# Altium schematic sheet 0171_IMVP VCCCORE_SOC_ .SchDoc
size 848 x 558 mm
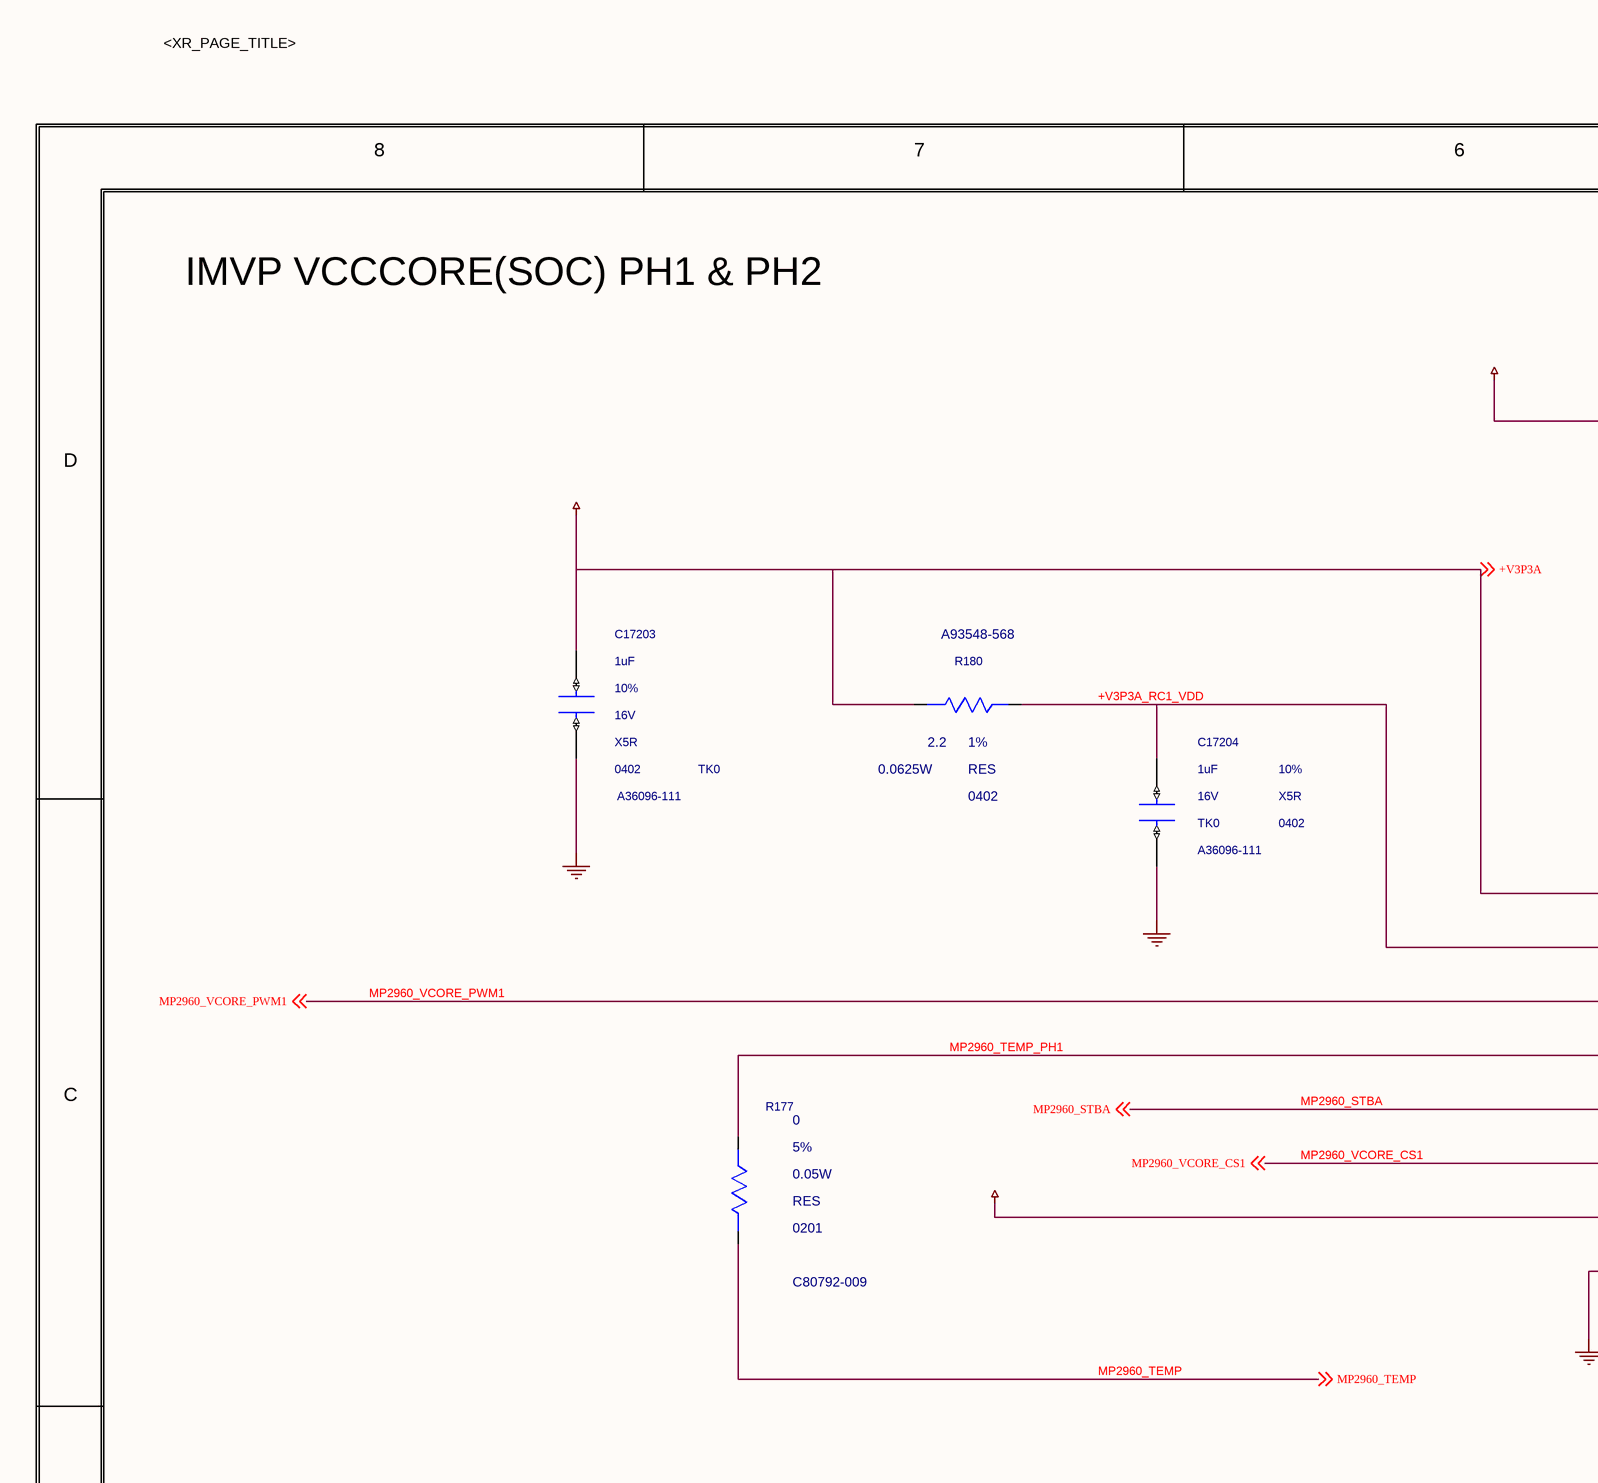
[diagram p0: 0171_IMVP VCCCORE_SOC_ .SchDoc, top left]
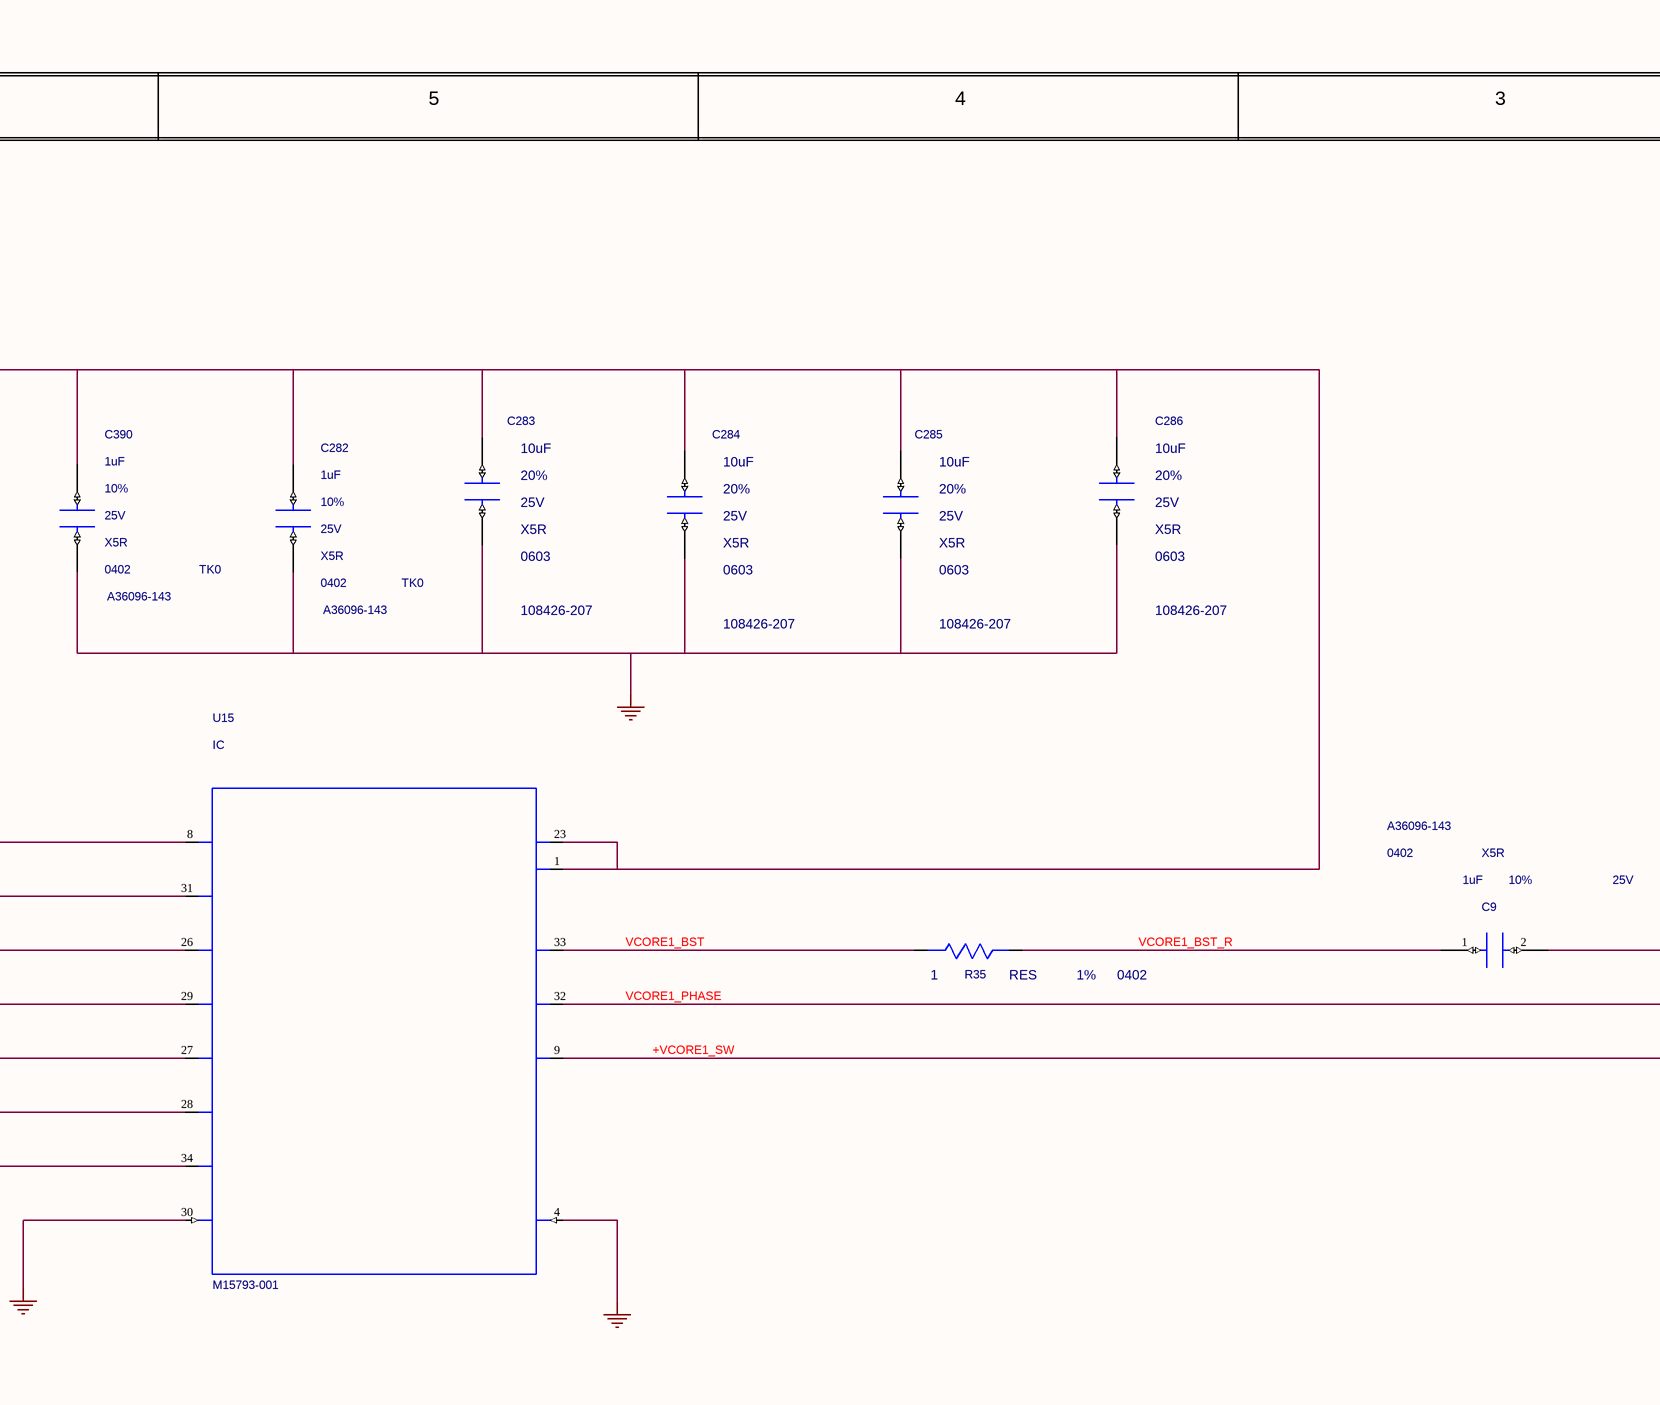
[diagram p1: 0171_IMVP VCCCORE_SOC_ .SchDoc, top middle]
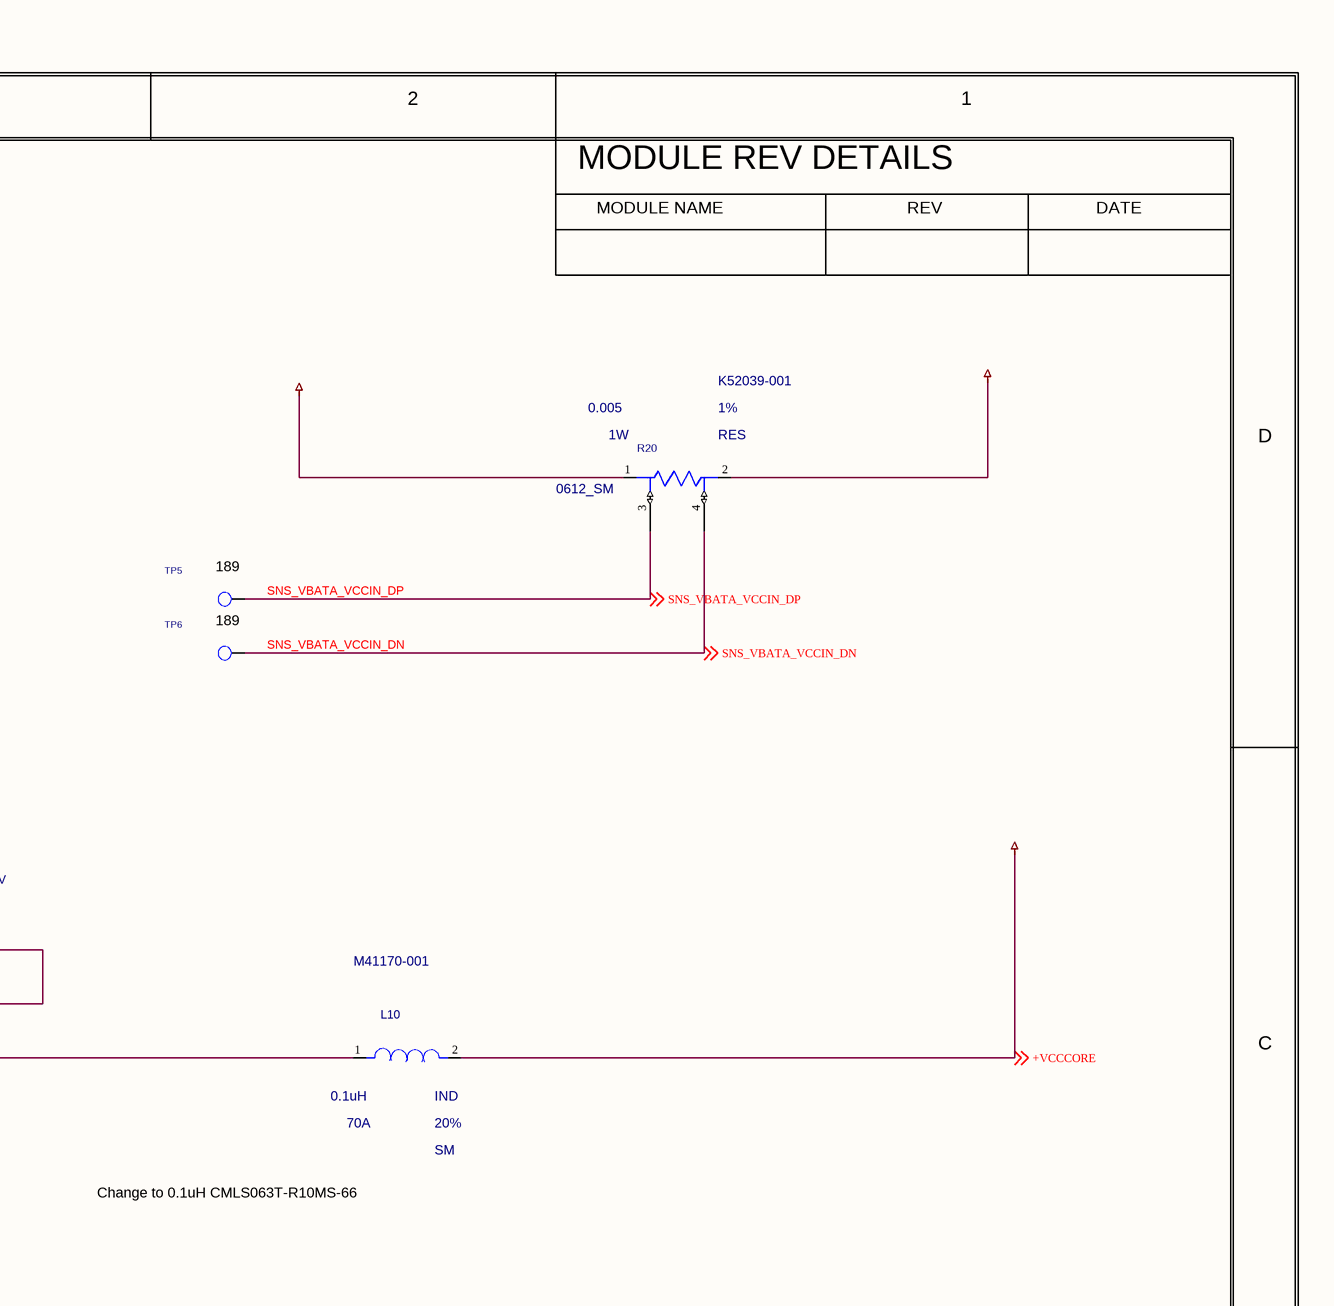
[diagram p2: 0171_IMVP VCCCORE_SOC_ .SchDoc, top right]
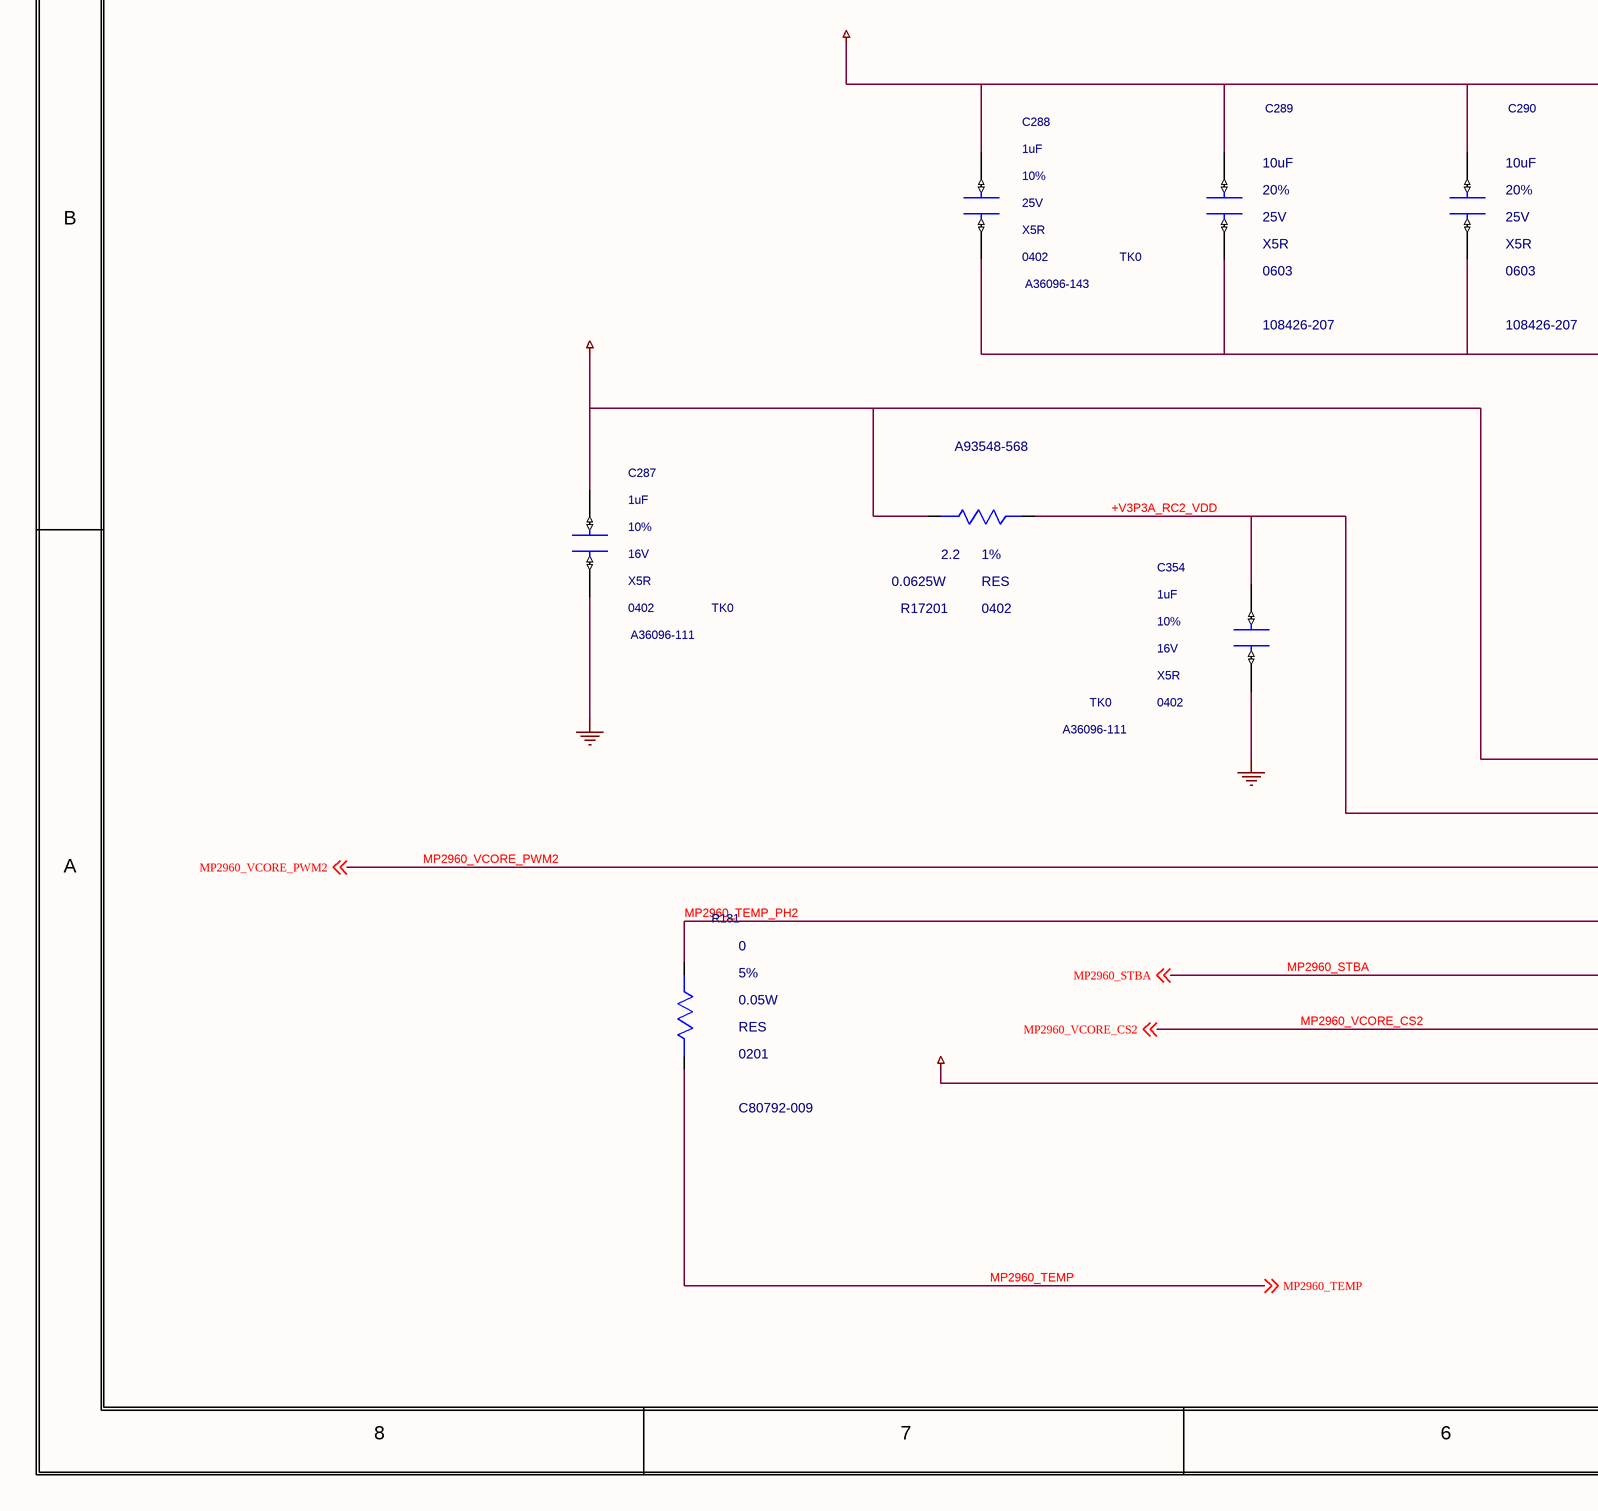
[diagram p3: 0171_IMVP VCCCORE_SOC_ .SchDoc, bottom left]
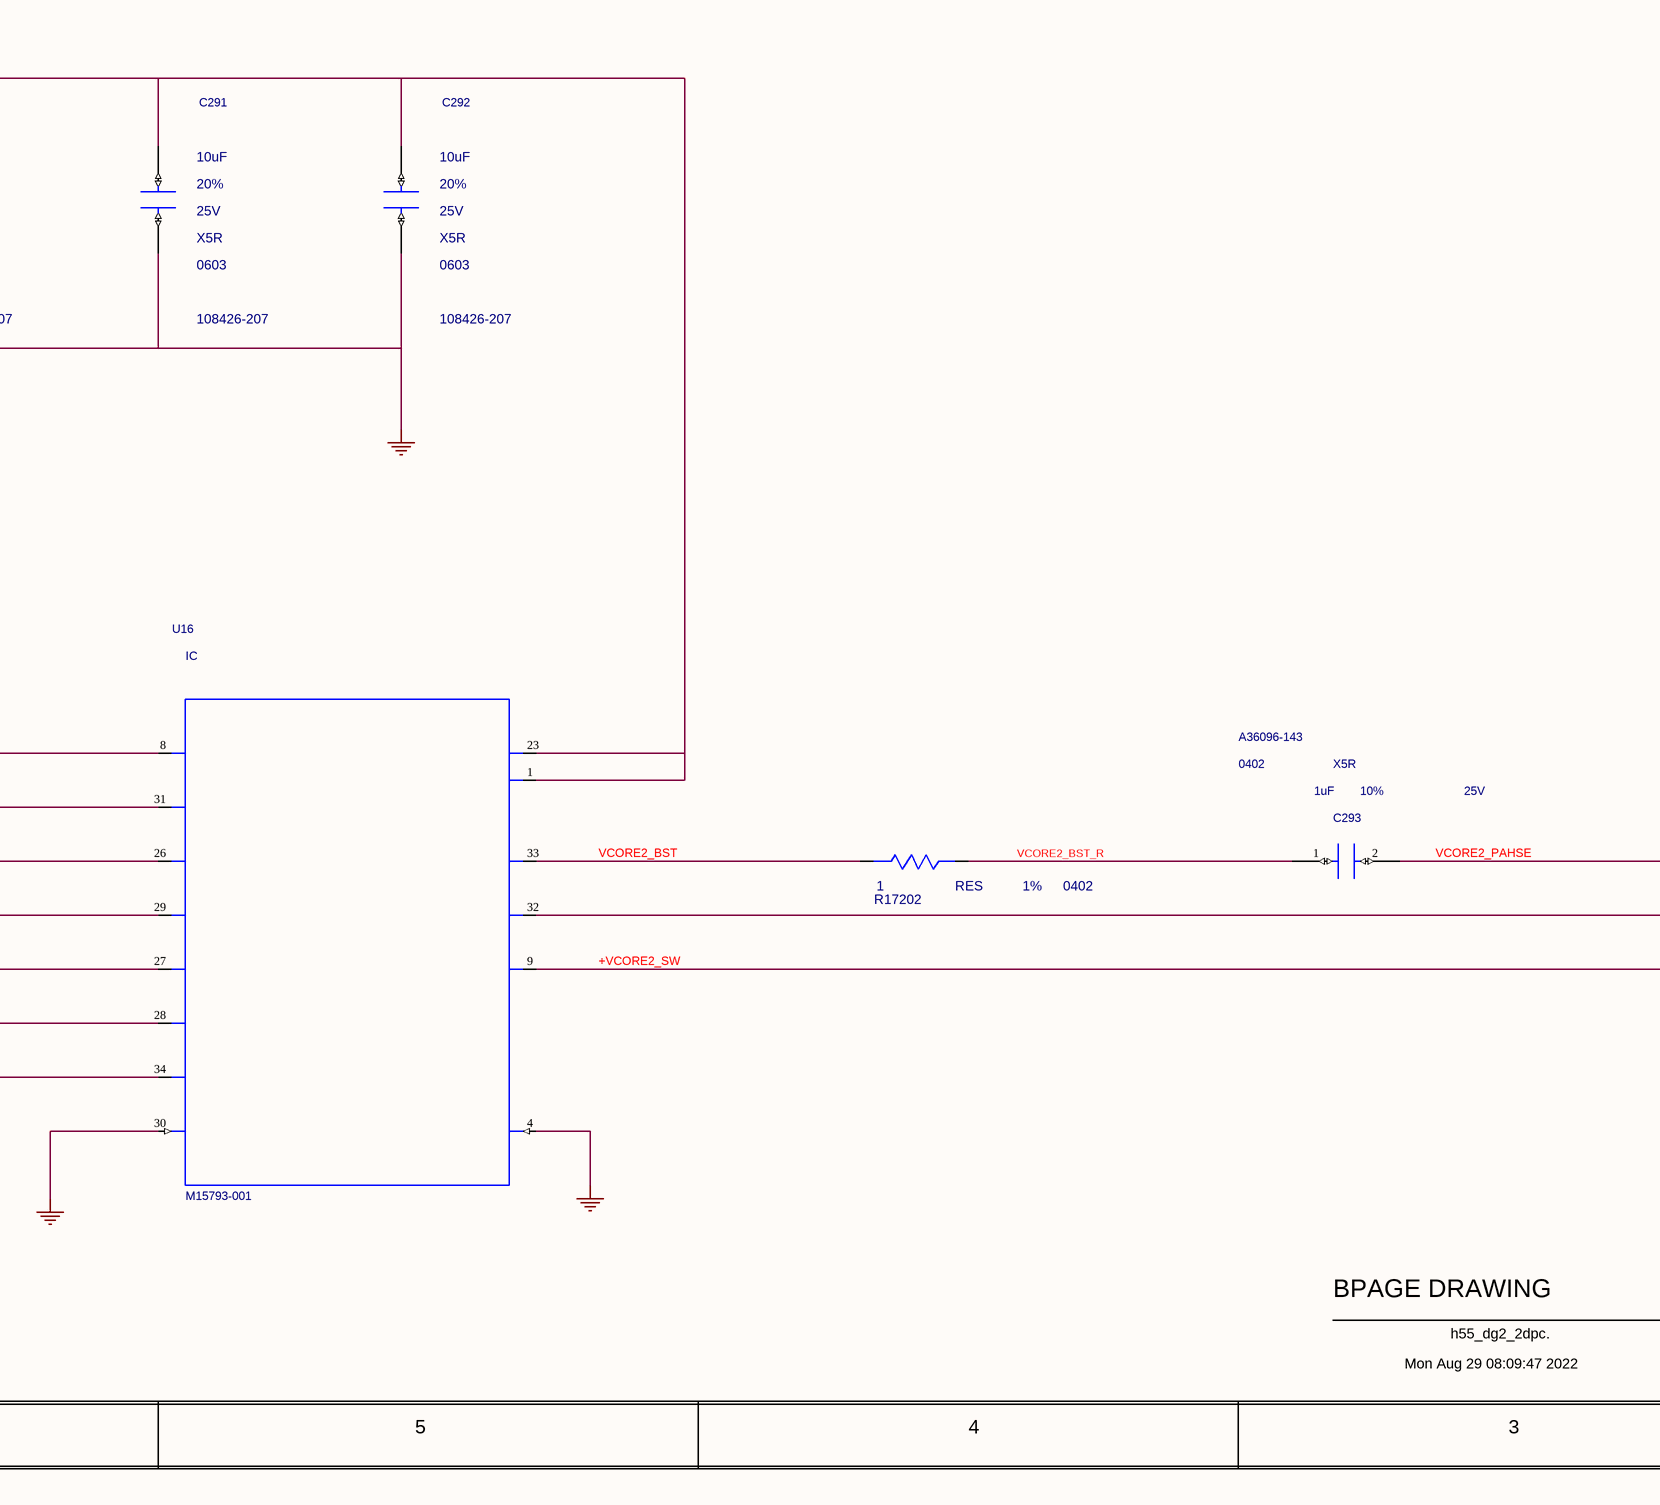
[diagram p4: 0171_IMVP VCCCORE_SOC_ .SchDoc, bottom middle]
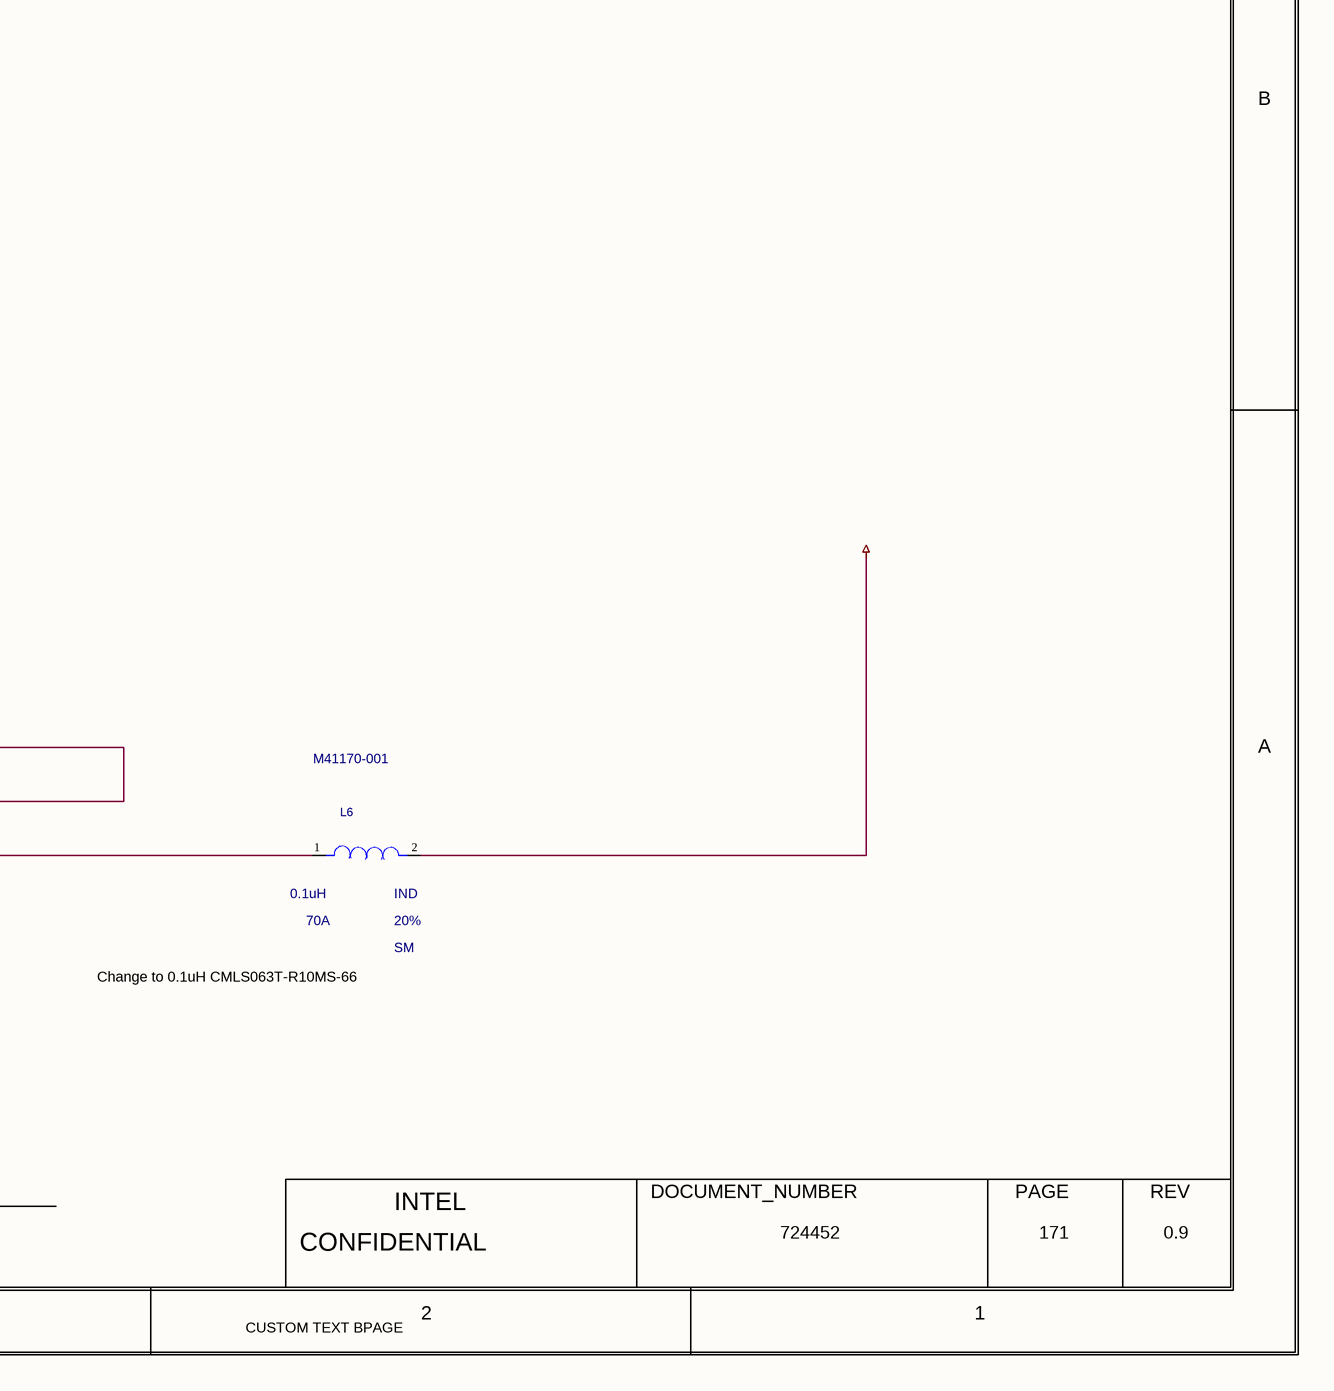
[diagram p5: 0171_IMVP VCCCORE_SOC_ .SchDoc, bottom right]

## Parts
C9  1uF  MATERIAL: X5R  PACK_TYPE: 0402  PART_NUMBER: A36096-143  TOLERANCE: 10%  VOLTAGE: 25V  [SMC0402MA]
C282  1uF  FP_TECH: TK0  MATERIAL: X5R  PACK_TYPE: 0402  PART_NUMBER: A36096-143  TOLERANCE: 10%  VOLTAGE: 25V  [CTK0_SM0402_1050X550_MA]
C283  10uF  MATERIAL: X5R  PACK_TYPE: 0603  PART_NUMBER: 108426-207  TOLERANCE: 20%  VOLTAGE: 25V  [CTK2_SM0603_1800X1000_MA]
C284  10uF  MATERIAL: X5R  PACK_TYPE: 0603  PART_NUMBER: 108426-207  TOLERANCE: 20%  VOLTAGE: 25V  [CTK2_SM0603_1800X1000_MA]
C285  10uF  MATERIAL: X5R  PACK_TYPE: 0603  PART_NUMBER: 108426-207  TOLERANCE: 20%  VOLTAGE: 25V  [CTK2_SM0603_1800X1000_MA]
C286  10uF  MATERIAL: X5R  PACK_TYPE: 0603  PART_NUMBER: 108426-207  TOLERANCE: 20%  VOLTAGE: 25V  [CTK2_SM0603_1800X1000_MA]
C287  1uF  FP_TECH: TK0  MATERIAL: X5R  PACK_TYPE: 0402  PART_NUMBER: A36096-111  TOLERANCE: 10%  VOLTAGE: 16V  [CTK0_SM0402_1050X550_MA]
C288  1uF  FP_TECH: TK0  MATERIAL: X5R  PACK_TYPE: 0402  PART_NUMBER: A36096-143  TOLERANCE: 10%  VOLTAGE: 25V  [CTK0_SM0402_1050X550_MA]
C289  10uF  MATERIAL: X5R  PACK_TYPE: 0603  PART_NUMBER: 108426-207  TOLERANCE: 20%  VOLTAGE: 25V  [CTK2_SM0603_1800X1000_MA]
C290  10uF  MATERIAL: X5R  PACK_TYPE: 0603  PART_NUMBER: 108426-207  TOLERANCE: 20%  VOLTAGE: 25V  [CTK2_SM0603_1800X1000_MA]
C291  10uF  MATERIAL: X5R  PACK_TYPE: 0603  PART_NUMBER: 108426-207  TOLERANCE: 20%  VOLTAGE: 25V  [CTK2_SM0603_1800X1000_MA]
C292  10uF  MATERIAL: X5R  PACK_TYPE: 0603  PART_NUMBER: 108426-207  TOLERANCE: 20%  VOLTAGE: 25V  [CTK2_SM0603_1800X1000_MA]
C293  1uF  MATERIAL: X5R  PACK_TYPE: 0402  PART_NUMBER: A36096-143  TOLERANCE: 10%  VOLTAGE: 25V  [SMC0402MA]
C354  1uF  FP_TECH: TK0  MATERIAL: X5R  PACK_TYPE: 0402  PART_NUMBER: A36096-111  TOLERANCE: 10%  VOLTAGE: 16V  [CTK0_SM0402_1050X550_MA]
C390  1uF  FP_TECH: TK0  MATERIAL: X5R  PACK_TYPE: 0402  PART_NUMBER: A36096-143  TOLERANCE: 10%  VOLTAGE: 25V  [CTK0_SM0402_1050X550_MA]
C17203  1uF  FP_TECH: TK0  MATERIAL: X5R  PACK_TYPE: 0402  PART_NUMBER: A36096-111  TOLERANCE: 10%  VOLTAGE: 16V  [CTK0_SM0402_1050X550_MA]
C17204  1uF  FP_TECH: TK0  MATERIAL: X5R  PACK_TYPE: 0402  PART_NUMBER: A36096-111  TOLERANCE: 10%  VOLTAGE: 16V  [CTK0_SM0402_1050X550_MA]
L6  0.1uH  CURRENT: 70A  MATERIAL: IND  PACK_TYPE: SM  PART_NUMBER: M41170-001  TOLERANCE: 20%  [CTK2_SM_7300X6800_MA]
L10  0.1uH  CURRENT: 70A  MATERIAL: IND  PACK_TYPE: SM  PART_NUMBER: M41170-001  TOLERANCE: 20%  [CTK2_SM_7300X6800_MA]
R20  0.005  MATERIAL: RES  PACK_TYPE: 0612_SM  PART_NUMBER: K52039-001  TOLERANCE: 1%  WATTAGE: 1W  [CTK0_SMR4_0612_1800X3450_MB_VR]
R35  1  MATERIAL: RES  PACK_TYPE: 0402  TOLERANCE: 1%  [CTK0_SM0402_1100X550_MA]
R177  0  MATERIAL: RES  PACK_TYPE: 0201  PART_NUMBER: C80792-009  TOLERANCE: 5%  WATTAGE: 0.05W  [CTK2_SM0201_630X330_MA]
R180  2.2  MATERIAL: RES  PACK_TYPE: 0402  PART_NUMBER: A93548-568  TOLERANCE: 1%  WATTAGE: 0.0625W  [CTK2_SM0402_1100X550_MA]
R181  0  MATERIAL: RES  PACK_TYPE: 0201  PART_NUMBER: C80792-009  TOLERANCE: 5%  WATTAGE: 0.05W  [CTK0_SM0201_630X330_MA]
R17201  2.2  MATERIAL: RES  PACK_TYPE: 0402  PART_NUMBER: A93548-568  TOLERANCE: 1%  WATTAGE: 0.0625W  [CTK2_SM0402_1100X550_MA]
R17202  1  MATERIAL: RES  PACK_TYPE: 0402  TOLERANCE: 1%  [CTK0_SM0402_1100X550_MA]
TP5  TP  [TP_C25]  (value not drawn)
TP6  TP  [TP_C25]  (value not drawn)
U15  MATERIAL: IC  PART_NUMBER: M15793-001  [CTK1_LCC34_4100X6100_450_DF4P_MA_VR]  (hidden comment: C_MP86959)
U16  MATERIAL: IC  PART_NUMBER: M15793-001  [CTK1_LCC34_4100X6100_450_DF4P_MA_VR]  (hidden comment: C_MP86959)

## Nets
+V3P3A: C287.1(A) C17203.1(A) R180.1(A) R17201.1(A) U15.8(VDRV) U15.34(TEST) U16.8(VDRV) U16.34(TEST) ; off-sheet +V3P3A
+VBATA: R20.1(PWRA)
+VBATA_VCCIN: C282.1(A) C283.1(A) C284.1(A) C285.1(A) C286.1(A) C288.1(A) C289.1(A) C290.1(A) C291.1(A) C292.1(A) C390.1(A) R20.2(PWRB) U15.1(VIN_1) U15.23(VIN_2) U16.1(VIN_1) U16.23(VIN_2)
+VCCCORE: L6.2(INB) L10.2(INB) ; off-sheet +VCCCORE
GND: C282.2(B) C283.2(B) C284.2(B) C285.2(B) C286.2(B) C287.2(B) C288.2(B) C289.2(B) C290.2(B) C291.2(B) C292.2(B) C354.2(B) C390.2(B) C17203.2(B) C17204.2(B) U15.4(PGND) U15.30(AGND) U16.4(PGND) U16.30(AGND)
+V3P3A_RC1_VDD: C17204.1(A) R180.2(B) U15.31(VDD)
+V3P3A_RC2_VDD: C354.1(A) R17201.2(B) U16.31(VDD)
+VCORE1_SW: L10.1(INA) U15.9(SW)
+VCORE2_SW: L6.1(INA) U16.9(SW)
MP2960_STBA: U15.27(SYNC) U16.27(SYNC) ; off-sheet MP2960_STBA
MP2960_TEMP: R177.2(B) R181.2(B) ; off-sheet MP2960_TEMP
MP2960_TEMP_PH1: R177.1(A) U15.29(VTEMP_FLT)
MP2960_TEMP_PH2: R181.1(A) U16.29(VTEMP_FLT)
MP2960_VCORE_CS1: U15.28(CS) ; off-sheet MP2960_VCORE_CS1
MP2960_VCORE_CS2: U16.28(CS) ; off-sheet MP2960_VCORE_CS2
MP2960_VCORE_PWM1: U15.26(PWM) ; off-sheet MP2960_VCORE_PWM1
MP2960_VCORE_PWM2: U16.26(PWM) ; off-sheet MP2960_VCORE_PWM2
SNS_VBATA_VCCIN_DN: R20.4(SENB) TP6.1(TP) ; off-sheet SNS_VBATA_VCCIN_DN
SNS_VBATA_VCCIN_DP: R20.3(SENA) TP5.1(TP) ; off-sheet SNS_VBATA_VCCIN_DP
VCORE1_BST: R35.1(A) U15.33(BST)
VCORE1_BST_R: C9.1(A) R35.2(B)
VCORE1_PHASE: C9.2(B) U15.32(PHASE)
VCORE2_BST: R17202.1(A) U16.33(BST)
VCORE2_BST_R: C293.1(A) R17202.2(B)
VCORE2_PAHSE: C293.2(B) U16.32(PHASE)

## Notes on the sheet
- <XR_PAGE_TITLE>
- 8
- 7
- 6
- 5
- 4
- 3
- 2
- 1
- MODULE REV DETAILS
- IMVP VCCCORE(SOC) PH1 & PH2
- MODULE NAME
- REV
- DATE
- D
- (near TP5) 189
- 189
- C
- Change to 0.1uH CMLS063T-R10MS-66
- B
- A
- BPAGE DRAWING
- INTEL
- DOCUMENT_NUMBER
- PAGE
- Mon Aug 29 08:09:47 2022
- h55_dg2_2dpc.
- CONFIDENTIAL
- 724452
- 171
- 0.9
- CUSTOM TEXT BPAGE

## Library data of the parts
C9 = CAP#1: CHIPS_PART_NAME: CAP; CDS_PHYS_PART_NAME: CAP_0402-A36096-143,X5R,1UF,25V,10%,LPDB,GENERIC; OriginalSymbolOrigin: (-25,50); XY: (2675,2975); VER: 2; ROT: 0; PHYS_PAGE: 171; LOCATION: C9; DRAWING: @RVP1_ADL_SB_ADP_S_DDR5_SODIMM_2DPC_LIB.H55_DG2_2DPC(SCH_1):PAGE540; CDS_LIB: discrete; PCB Footprint: SMC0402MA; CDS_PART_NAME: CAP_0402-A36096-143,X5R,1UF,25V,10%,LPDB,GENERIC; CDS_LOCATION: C9
C282 = C_CAP: CDS_PHYS_PART_NAME: C_CAP_0402-A36096-143,X5R,1UF,25V,10%,TK0,GENERIC; CDS_LMAN_SYM_OUTLINE: -50,50,50,-50; IP: GENERIC; ROOM: NONE; OriginalSymbolOrigin: (-50,25); XY: (450,3775); VER: 1; ROT: 0; PHYS_PAGE: 171; LOCATION: C282; DRAWING: @RVP1_ADL_SB_ADP_S_DDR5_SODIMM_2DPC_LIB.H55_DG2_2DPC(SCH_1):PAGE540; CDS_LIB: c_discrete; VARIANT: ?; PCB Footprint: CTK0_SM0402_1050X550_MA; CHIPS_PART_NAME: C_CAP; CDS_PART_NAME: C_CAP_0402-A36096-143,X5R,1UF,25V,10%,TK0,GENERIC; CDS_LOCATION: C282
C283 = C_CAP: CDS_PHYS_PART_NAME: C_CAP_0603-108426-207,X5R,10UF,25V,20%,TK2,GENERIC; CDS_LMAN_SYM_OUTLINE: -50,50,50,-50; FP_TECH: TK2; IP: GENERIC; ROOM: NONE; OriginalSymbolOrigin: (-50,25); XY: (800,3825); VER: 1; ROT: 0; PHYS_PAGE: 171; LOCATION: C283; DRAWING: @RVP1_ADL_SB_ADP_S_DDR5_SODIMM_2DPC_LIB.H55_DG2_2DPC(SCH_1):PAGE540; CDS_LIB: c_discrete; VARIANT: ?; PCB Footprint: CTK2_SM0603_1800X1000_MA; CHIPS_PART_NAME: C_CAP; CDS_PART_NAME: C_CAP_0603-108426-207,X5R,10UF,25V,20%,TK2,GENERIC; CDS_LOCATION: C283
C284 = C_CAP: CDS_PHYS_PART_NAME: C_CAP_0603-108426-207,X5R,10UF,25V,20%,TK2,GENERIC; CDS_LMAN_SYM_OUTLINE: -50,50,50,-50; FP_TECH: TK2; IP: GENERIC; ROOM: NONE; OriginalSymbolOrigin: (-50,25); XY: (1175,3800); VER: 1; ROT: 0; PHYS_PAGE: 171; LOCATION: C284; DRAWING: @RVP1_ADL_SB_ADP_S_DDR5_SODIMM_2DPC_LIB.H55_DG2_2DPC(SCH_1):PAGE540; CDS_LIB: c_discrete; VARIANT: ?; PCB Footprint: CTK2_SM0603_1800X1000_MA; CHIPS_PART_NAME: C_CAP; CDS_PART_NAME: C_CAP_0603-108426-207,X5R,10UF,25V,20%,TK2,GENERIC; CDS_LOCATION: C284
C285 = C_CAP: CDS_PHYS_PART_NAME: C_CAP_0603-108426-207,X5R,10UF,25V,20%,TK2,GENERIC; CDS_LMAN_SYM_OUTLINE: -50,50,50,-50; FP_TECH: TK2; IP: GENERIC; ROOM: NONE; OriginalSymbolOrigin: (-50,25); XY: (1575,3800); VER: 1; ROT: 0; PHYS_PAGE: 171; LOCATION: C285; DRAWING: @RVP1_ADL_SB_ADP_S_DDR5_SODIMM_2DPC_LIB.H55_DG2_2DPC(SCH_1):PAGE540; CDS_LIB: c_discrete; VARIANT: ?; PCB Footprint: CTK2_SM0603_1800X1000_MA; CHIPS_PART_NAME: C_CAP; CDS_PART_NAME: C_CAP_0603-108426-207,X5R,10UF,25V,20%,TK2,GENERIC; CDS_LOCATION: C285
C286 = C_CAP: CDS_PHYS_PART_NAME: C_CAP_0603-108426-207,X5R,10UF,25V,20%,TK2,GENERIC; CDS_LMAN_SYM_OUTLINE: -50,50,50,-50; FP_TECH: TK2; IP: GENERIC; ROOM: NONE; OriginalSymbolOrigin: (-50,25); XY: (1975,3825); VER: 1; ROT: 0; PHYS_PAGE: 171; LOCATION: C286; DRAWING: @RVP1_ADL_SB_ADP_S_DDR5_SODIMM_2DPC_LIB.H55_DG2_2DPC(SCH_1):PAGE540; CDS_LIB: c_discrete; VARIANT: ?; PCB Footprint: CTK2_SM0603_1800X1000_MA; CHIPS_PART_NAME: C_CAP; CDS_PART_NAME: C_CAP_0603-108426-207,X5R,10UF,25V,20%,TK2,GENERIC; CDS_LOCATION: C286
C287 = C_CAP: CDS_PHYS_PART_NAME: C_CAP_0402-A36096-111,X5R,1UF,16V,10%,TK0,GENERIC; CDS_LMAN_SYM_OUTLINE: -50,50,50,-50; IP: GENERIC; ROOM: NONE; OriginalSymbolOrigin: (-50,25); XY: (-1900,1075); VER: 1; ROT: 0; PHYS_PAGE: 171; LOCATION: C287; DRAWING: @RVP1_ADL_SB_ADP_S_DDR5_SODIMM_2DPC_LIB.H55_DG2_2DPC(SCH_1):PAGE540; CDS_LIB: c_discrete; VARIANT: ?; PCB Footprint: CTK0_SM0402_1050X550_MA; CHIPS_PART_NAME: C_CAP; CDS_PART_NAME: C_CAP_0402-A36096-111,X5R,1UF,16V,10%,TK0,GENERIC; CDS_LOCATION: C287
C288 = C_CAP: CDS_PHYS_PART_NAME: C_CAP_0402-A36096-143,X5R,1UF,25V,10%,TK0,GENERIC; CDS_LMAN_SYM_OUTLINE: -50,50,50,-50; IP: GENERIC; ROOM: NONE; OriginalSymbolOrigin: (-50,25); XY: (-1175,1700); VER: 1; ROT: 0; PHYS_PAGE: 171; LOCATION: C288; DRAWING: @RVP1_ADL_SB_ADP_S_DDR5_SODIMM_2DPC_LIB.H55_DG2_2DPC(SCH_1):PAGE540; CDS_LIB: c_discrete; VARIANT: ?; PCB Footprint: CTK0_SM0402_1050X550_MA; CHIPS_PART_NAME: C_CAP; CDS_PART_NAME: C_CAP_0402-A36096-143,X5R,1UF,25V,10%,TK0,GENERIC; CDS_LOCATION: C288
C289 = C_CAP: CDS_PHYS_PART_NAME: C_CAP_0603-108426-207,X5R,10UF,25V,20%,TK2,GENERIC; CDS_LMAN_SYM_OUTLINE: -50,50,50,-50; FP_TECH: TK2; IP: GENERIC; ROOM: NONE; OriginalSymbolOrigin: (-50,25); XY: (-725,1700); VER: 1; ROT: 0; PHYS_PAGE: 171; LOCATION: C289; DRAWING: @RVP1_ADL_SB_ADP_S_DDR5_SODIMM_2DPC_LIB.H55_DG2_2DPC(SCH_1):PAGE540; CDS_LIB: c_discrete; VARIANT: ?; PCB Footprint: CTK2_SM0603_1800X1000_MA; CHIPS_PART_NAME: C_CAP; CDS_PART_NAME: C_CAP_0603-108426-207,X5R,10UF,25V,20%,TK2,GENERIC; CDS_LOCATION: C289
C290 = C_CAP: CDS_PHYS_PART_NAME: C_CAP_0603-108426-207,X5R,10UF,25V,20%,TK2,GENERIC; CDS_LMAN_SYM_OUTLINE: -50,50,50,-50; FP_TECH: TK2; IP: GENERIC; ROOM: NONE; OriginalSymbolOrigin: (-50,25); XY: (-275,1700); VER: 1; ROT: 0; PHYS_PAGE: 171; LOCATION: C290; DRAWING: @RVP1_ADL_SB_ADP_S_DDR5_SODIMM_2DPC_LIB.H55_DG2_2DPC(SCH_1):PAGE540; CDS_LIB: c_discrete; VARIANT: ?; PCB Footprint: CTK2_SM0603_1800X1000_MA; CHIPS_PART_NAME: C_CAP; CDS_PART_NAME: C_CAP_0603-108426-207,X5R,10UF,25V,20%,TK2,GENERIC; CDS_LOCATION: C290
C291 = C_CAP: CDS_PHYS_PART_NAME: C_CAP_0603-108426-207,X5R,10UF,25V,20%,TK2,GENERIC; CDS_LMAN_SYM_OUTLINE: -50,50,50,-50; FP_TECH: TK2; IP: GENERIC; ROOM: NONE; OriginalSymbolOrigin: (-50,25); XY: (200,1700); VER: 1; ROT: 0; PHYS_PAGE: 171; LOCATION: C291; DRAWING: @RVP1_ADL_SB_ADP_S_DDR5_SODIMM_2DPC_LIB.H55_DG2_2DPC(SCH_1):PAGE540; CDS_LIB: c_discrete; VARIANT: ?; PCB Footprint: CTK2_SM0603_1800X1000_MA; CHIPS_PART_NAME: C_CAP; CDS_PART_NAME: C_CAP_0603-108426-207,X5R,10UF,25V,20%,TK2,GENERIC; CDS_LOCATION: C291
C292 = C_CAP: CDS_PHYS_PART_NAME: C_CAP_0603-108426-207,X5R,10UF,25V,20%,TK2,GENERIC; CDS_LMAN_SYM_OUTLINE: -50,50,50,-50; FP_TECH: TK2; IP: GENERIC; ROOM: NONE; OriginalSymbolOrigin: (-50,25); XY: (650,1700); VER: 1; ROT: 0; PHYS_PAGE: 171; LOCATION: C292; DRAWING: @RVP1_ADL_SB_ADP_S_DDR5_SODIMM_2DPC_LIB.H55_DG2_2DPC(SCH_1):PAGE540; CDS_LIB: c_discrete; VARIANT: ?; PCB Footprint: CTK2_SM0603_1800X1000_MA; CHIPS_PART_NAME: C_CAP; CDS_PART_NAME: C_CAP_0603-108426-207,X5R,10UF,25V,20%,TK2,GENERIC; CDS_LOCATION: C292
C293 = CAP#1: CHIPS_PART_NAME: CAP; CDS_PHYS_PART_NAME: CAP_0402-A36096-143,X5R,1UF,25V,10%,LPDB,GENERIC; OriginalSymbolOrigin: (-25,50); XY: (2400,475); VER: 2; ROT: 0; PHYS_PAGE: 171; LOCATION: C293; DRAWING: @RVP1_ADL_SB_ADP_S_DDR5_SODIMM_2DPC_LIB.H55_DG2_2DPC(SCH_1):PAGE540; CDS_LIB: discrete; PCB Footprint: SMC0402MA; CDS_PART_NAME: CAP_0402-A36096-143,X5R,1UF,25V,10%,LPDB,GENERIC; CDS_LOCATION: C293
C354 = C_CAP: CDS_PHYS_PART_NAME: C_CAP_0402-A36096-111,X5R,1UF,16V,10%,TK0,GENERIC; CDS_LMAN_SYM_OUTLINE: -50,50,50,-50; IP: GENERIC; ROOM: NONE; OriginalSymbolOrigin: (-50,25); XY: (-675,900); VER: 1; ROT: 0; PHYS_PAGE: 171; LOCATION: C354; DRAWING: @RVP1_ADL_SB_ADP_S_DDR5_SODIMM_2DPC_LIB.H55_DG2_2DPC(SCH_1):PAGE540; CDS_LIB: c_discrete; VARIANT: ?; PCB Footprint: CTK0_SM0402_1050X550_MA; CHIPS_PART_NAME: C_CAP; CDS_PART_NAME: C_CAP_0402-A36096-111,X5R,1UF,16V,10%,TK0,GENERIC; CDS_LOCATION: C354
C390 = C_CAP: CDS_PHYS_PART_NAME: C_CAP_0402-A36096-143,X5R,1UF,25V,10%,TK0,GENERIC; CDS_LMAN_SYM_OUTLINE: -50,50,50,-50; IP: GENERIC; ROOM: NONE; OriginalSymbolOrigin: (-50,25); XY: (50,3775); VER: 1; ROT: 0; PHYS_PAGE: 171; LOCATION: C390; DRAWING: @RVP1_ADL_SB_ADP_S_DDR5_SODIMM_2DPC_LIB.H55_DG2_2DPC(SCH_1):PAGE540; CDS_LIB: c_discrete; VARIANT: ?; PCB Footprint: CTK0_SM0402_1050X550_MA; CHIPS_PART_NAME: C_CAP; CDS_PART_NAME: C_CAP_0402-A36096-143,X5R,1UF,25V,10%,TK0,GENERIC; CDS_LOCATION: C390
C17203 = C_CAP: CDS_PHYS_PART_NAME: C_CAP_0402-A36096-111,X5R,1UF,16V,10%,TK0,GENERIC; CDS_LMAN_SYM_OUTLINE: -50,50,50,-50; IP: GENERIC; ROOM: NONE; OriginalSymbolOrigin: (-50,25); XY: (-1925,3525); VER: 1; ROT: 0; PHYS_PAGE: 171; LOCATION: C17203; DRAWING: @RVP1_ADL_SB_ADP_S_DDR5_SODIMM_2DPC_LIB.H55_DG2_2DPC(SCH_1):PAGE540; CDS_LIB: c_discrete; VARIANT: ?; PCB Footprint: CTK0_SM0402_1050X550_MA; CHIPS_PART_NAME: C_CAP; CDS_PART_NAME: C_CAP_0402-A36096-111,X5R,1UF,16V,10%,TK0,GENERIC; CDS_LOCATION: C17203
C17204 = C_CAP: CDS_PHYS_PART_NAME: C_CAP_0402-A36096-111,X5R,1UF,16V,10%,TK0,GENERIC; CDS_LMAN_SYM_OUTLINE: -50,50,50,-50; IP: GENERIC; ROOM: NONE; OriginalSymbolOrigin: (-50,25); XY: (-850,3325); VER: 1; ROT: 0; PHYS_PAGE: 171; LOCATION: C17204; DRAWING: @RVP1_ADL_SB_ADP_S_DDR5_SODIMM_2DPC_LIB.H55_DG2_2DPC(SCH_1):PAGE540; CDS_LIB: c_discrete; VARIANT: ?; PCB Footprint: CTK0_SM0402_1050X550_MA; CHIPS_PART_NAME: C_CAP; CDS_PART_NAME: C_CAP_0402-A36096-111,X5R,1UF,16V,10%,TK0,GENERIC; CDS_LOCATION: C17204
L6 = C_INDUCTOR: CDS_PHYS_PART_NAME: C_INDUCTOR_SM-M41170-001,IND,0.1UH,20%,70A,TK2,GENERIC; CDS_LMAN_SYM_OUTLINE: -100,50,100,-50; FP_TECH: TK2; IP: GENERIC; ROOM: NONE; OriginalSymbolOrigin: (-75,25); XY: (3600,275); VER: 1; ROT: 0; PHYS_PAGE: 171; LOCATION: L6; DRAWING: @RVP1_ADL_SB_ADP_S_DDR5_SODIMM_2DPC_LIB.H55_DG2_2DPC(SCH_1):PAGE540; CDS_LIB: local; VARIANT: ?; PCB Footprint: CTK2_SM_7300X6800_MA; CHIPS_PART_NAME: C_INDUCTOR; CDS_PART_NAME: C_INDUCTOR_SM-M41170-001,IND,0.1UH,20%,70A,TK2,GENERIC; CDS_LOCATION: L6
L10 = C_INDUCTOR: CDS_PHYS_PART_NAME: C_INDUCTOR_SM-M41170-001,IND,0.1UH,20%,70A,TK2,GENERIC; CDS_LMAN_SYM_OUTLINE: -100,50,100,-50; FP_TECH: TK2; IP: GENERIC; ROOM: NONE; OriginalSymbolOrigin: (-75,25); XY: (3675,2775); VER: 1; ROT: 0; PHYS_PAGE: 171; LOCATION: L10; DRAWING: @RVP1_ADL_SB_ADP_S_DDR5_SODIMM_2DPC_LIB.H55_DG2_2DPC(SCH_1):PAGE540; CDS_LIB: local; VARIANT: ?; PCB Footprint: CTK2_SM_7300X6800_MA; CHIPS_PART_NAME: C_INDUCTOR; CDS_PART_NAME: C_INDUCTOR_SM-M41170-001,IND,0.1UH,20%,70A,TK2,GENERIC; CDS_LOCATION: L10
R20 = C_RES_4TERM: CDS_PHYS_PART_NAME: C_RES_4TERM_0612_SM-K52039-001,RES,0.005,1%,1W,TK0,GENERIC; CDS_LMAN_SYM_OUTLINE: -50,50,50,-50; FP_TECH: TK0; IP: GENERIC; ROOM: NONE; OriginalSymbolOrigin: (-75,25); XY: (4175,3850); VER: 1; SUB_ROOM_2: PMR; SUB_ROOM_1: V_CHRG_LDO; ROT: 0; PHYS_PAGE: 171; LOCATION: R20; DRAWING: @RVP1_ADL_SB_ADP_S_DDR5_SODIMM_2DPC_LIB.H55_DG2_2DPC(SCH_1):PAGE540; CDS_LIB: c_discrete; VARIANT: ?; PCB Footprint: CTK0_SMR4_0612_1800X3450_MB_VR; SUB_ROOM: PMR; CHIPS_PART_NAME: C_RES_4TERM; CDS_PART_NAME: C_RES_4TERM_0612_SM-K52039-001,RES,0.005,1%,1W,TK0,GENERIC; CDS_LOCATION: R20
R35 = C_RES#1: PART_NUMBER: A93548-210; CHIPS_PART_NAME: C_RES; CDS_PHYS_PART_NAME: C_RES_0402-A93548-210,RES,1,1%,0.0625W,TK0,GENERIC; CDS_LMAN_SYM_OUTLINE: -50,50,50,-50; FP_TECH: TK0; IP: GENERIC; ROOM: NONE; WATTAGE: 0.0625W; OriginalSymbolOrigin: (-75,25); XY: (1700,2975); ROT: 0; PHYS_PAGE: 171; LOCATION: R35; DRAWING: @RVP1_ADL_SB_ADP_S_DDR5_SODIMM_2DPC_LIB.H55_DG2_2DPC(SCH_1):PAGE540; CDS_LIB: c_discrete; VARIANT: ?; PCB Footprint: CTK0_SM0402_1100X550_MA; VER: 1; CDS_PART_NAME: C_RES_0402-A93548-210,RES,1,1%,0.0625W,TK0,GENERIC; CDS_LOCATION: R35
R177 = C_RES: CDS_PHYS_PART_NAME: C_RES_0201-C80792-009,RES,0,5%,0.05W,TK2,GENERIC; CDS_LMAN_SYM_OUTLINE: -50,50,50,-50; FP_TECH: TK2; IP: GENERIC; ROOM: NONE; OriginalSymbolOrigin: (-25,75); XY: (-1625,2625); VER: 2; SUB_ROOM: VCCSA; PHYS_PAGE: 171; LOCATION: R177; DRAWING: @RVP1_ADL_SB_ADP_S_DDR5_SODIMM_2DPC_LIB.H55_DG2_2DPC(SCH_1):PAGE540; CDS_LIB: c_discrete; VARIANT: ?; PCB Footprint: CTK2_SM0201_630X330_MA; ROT: 0; CHIPS_PART_NAME: C_RES; CDS_PART_NAME: C_RES_0201-C80792-009,RES,0,5%,0.05W,TK2,GENERIC; CDS_LOCATION: R177
R180 = C_RES#1: CHIPS_PART_NAME: C_RES; CDS_PHYS_PART_NAME: C_RES_0402-A93548-568,RES,2.2,1%,0.0625W,TK2,GENERIC; CDS_LMAN_SYM_OUTLINE: -50,50,50,-50; FP_TECH: TK2; IP: GENERIC; ROOM: NONE; OriginalSymbolOrigin: (-75,25); XY: (-1200,3525); VER: 1; ROT: 0; PHYS_PAGE: 171; LOCATION: R180; DRAWING: @RVP1_ADL_SB_ADP_S_DDR5_SODIMM_2DPC_LIB.H55_DG2_2DPC(SCH_1):PAGE540; CDS_LIB: c_discrete; VARIANT: ?; PCB Footprint: CTK2_SM0402_1100X550_MA; CDS_PART_NAME: C_RES_0402-A93548-568,RES,2.2,1%,0.0625W,TK2,GENERIC; CDS_LOCATION: R180
R181 = C_RES: CDS_PHYS_PART_NAME: C_RES_0201-C80792-009,RES,0,5%,0.05W,TK0,GENERIC; CDS_LMAN_SYM_OUTLINE: -50,50,50,-50; FP_TECH: TK0; IP: GENERIC; ROOM: NONE; OriginalSymbolOrigin: (-25,75); XY: (-1725,200); VER: 2; SUB_ROOM: VCCSA; PHYS_PAGE: 171; LOCATION: R181; DRAWING: @RVP1_ADL_SB_ADP_S_DDR5_SODIMM_2DPC_LIB.H55_DG2_2DPC(SCH_1):PAGE540; CDS_LIB: c_discrete; VARIANT: ?; PCB Footprint: CTK0_SM0201_630X330_MA; ROT: 0; CHIPS_PART_NAME: C_RES; CDS_PART_NAME: C_RES_0201-C80792-009,RES,0,5%,0.05W,TK0,GENERIC; CDS_LOCATION: R181
R17201 = C_RES#1: CHIPS_PART_NAME: C_RES; CDS_PHYS_PART_NAME: C_RES_0402-A93548-568,RES,2.2,1%,0.0625W,TK2,GENERIC; CDS_LMAN_SYM_OUTLINE: -50,50,50,-50; FP_TECH: TK2; IP: GENERIC; ROOM: NONE; OriginalSymbolOrigin: (-75,25); XY: (-1175,1125); VER: 1; ROT: 0; PHYS_PAGE: 171; LOCATION: R17201; DRAWING: @RVP1_ADL_SB_ADP_S_DDR5_SODIMM_2DPC_LIB.H55_DG2_2DPC(SCH_1):PAGE540; CDS_LIB: c_discrete; VARIANT: ?; PCB Footprint: CTK2_SM0402_1100X550_MA; CDS_PART_NAME: C_RES_0402-A93548-568,RES,2.2,1%,0.0625W,TK2,GENERIC; CDS_LOCATION: R17201
R17202 = C_RES#1: PART_NUMBER: A93548-210; CHIPS_PART_NAME: C_RES; CDS_PHYS_PART_NAME: C_RES_0402-A93548-210,RES,1,1%,0.0625W,TK0,GENERIC; CDS_LMAN_SYM_OUTLINE: -50,50,50,-50; FP_TECH: TK0; IP: GENERIC; ROOM: NONE; WATTAGE: 0.0625W; OriginalSymbolOrigin: (-75,25); XY: (1600,475); ROT: 0; PHYS_PAGE: 171; LOCATION: R17202; DRAWING: @RVP1_ADL_SB_ADP_S_DDR5_SODIMM_2DPC_LIB.H55_DG2_2DPC(SCH_1):PAGE540; CDS_LIB: c_discrete; VARIANT: ?; PCB Footprint: CTK0_SM0402_1100X550_MA; VER: 1; CDS_PART_NAME: C_RES_0402-A93548-210,RES,1,1%,0.0625W,TK0,GENERIC; CDS_LOCATION: R17202
TP5 = TP#3: PART_NUMBER: NA_TPC25; CDS_PHYS_PART_NAME: TP_SM-NA_TPC25,EMPTY,TP_C25,LPDB,GENERIC; CDS_LMAN_SYM_OUTLINE: -100,50,100,-50; PACK_TYPE: SM; OriginalSymbolOrigin: (0,25); XY: (3325,3625); VER: 6; ROT: 0; ROOM: ROOM_PROP_TEST_70; PHYS_PAGE: 171; LOCATION: TP5; DRAWING: @RVP1_ADL_SB_ADP_S_DDR5_SODIMM_2DPC_LIB.H55_DG2_2DPC(SCH_1):PAGE540; CDS_LIB: board_artifacts; MATERIAL: EMPTY; PCB Footprint: TP_C25; CHIPS_PART_NAME: TP; CDS_PART_NAME: TP_SM-NA_TPC25,EMPTY,TP_C25,LPDB,GENERIC; CDS_LOCATION: TP5
TP6 = TP#3: PART_NUMBER: NA_TPC25; CDS_PHYS_PART_NAME: TP_SM-NA_TPC25,EMPTY,TP_C25,LPDB,GENERIC; CDS_LMAN_SYM_OUTLINE: -100,50,100,-50; PACK_TYPE: SM; OriginalSymbolOrigin: (0,25); XY: (3325,3525); VER: 6; ROT: 0; ROOM: ROOM_PROP_TEST_70; PHYS_PAGE: 171; LOCATION: TP6; DRAWING: @RVP1_ADL_SB_ADP_S_DDR5_SODIMM_2DPC_LIB.H55_DG2_2DPC(SCH_1):PAGE540; CDS_LIB: board_artifacts; MATERIAL: EMPTY; PCB Footprint: TP_C25; CHIPS_PART_NAME: TP; CDS_PART_NAME: TP_SM-NA_TPC25,EMPTY,TP_C25,LPDB,GENERIC; CDS_LOCATION: TP6
U15 = C_MP86959: CDS_PHYS_PART_NAME: C_MP86959_LCC-M15793-001,IC,MP86959GMW,TK1,GENERIC; CDS_LMAN_SYM_OUTLINE: -300,450,300,-450; FP_TECH: TK1; IP: GENERIC; PACK_TYPE: LCC; ROOM: NONE; OriginalSymbolOrigin: (-325,450); XY: (600,2825); VER: 1; ROT: 0; PHYS_PAGE: 171; LOCATION: U15; DRAWING: @RVP1_ADL_SB_ADP_S_DDR5_SODIMM_2DPC_LIB.H55_DG2_2DPC(SCH_1):PAGE540; CDS_LIB: local; VARIANT: ?; PCB Footprint: CTK1_LCC34_4100X6100_450_DF4P_MA_VR; SEC_TYPE: LCC; CHIPS_PART_NAME: C_MP86959; CDS_PART_NAME: C_MP86959_LCC-M15793-001,IC,MP86959GMW,TK1,GENERIC; CDS_LOCATION: U15
U16 = C_MP86959: CDS_PHYS_PART_NAME: C_MP86959_LCC-M15793-001,IC,MP86959GMW,TK1,GENERIC; CDS_LMAN_SYM_OUTLINE: -300,450,300,-450; FP_TECH: TK1; IP: GENERIC; PACK_TYPE: LCC; ROOM: NONE; OriginalSymbolOrigin: (-325,450); XY: (550,325); VER: 1; ROT: 0; PHYS_PAGE: 171; LOCATION: U16; DRAWING: @RVP1_ADL_SB_ADP_S_DDR5_SODIMM_2DPC_LIB.H55_DG2_2DPC(SCH_1):PAGE540; CDS_LIB: local; VARIANT: ?; PCB Footprint: CTK1_LCC34_4100X6100_450_DF4P_MA_VR; SEC_TYPE: LCC; CHIPS_PART_NAME: C_MP86959; CDS_PART_NAME: C_MP86959_LCC-M15793-001,IC,MP86959GMW,TK1,GENERIC; CDS_LOCATION: U16